# EAGLE schematic Main (EAGLE 9.2.2)
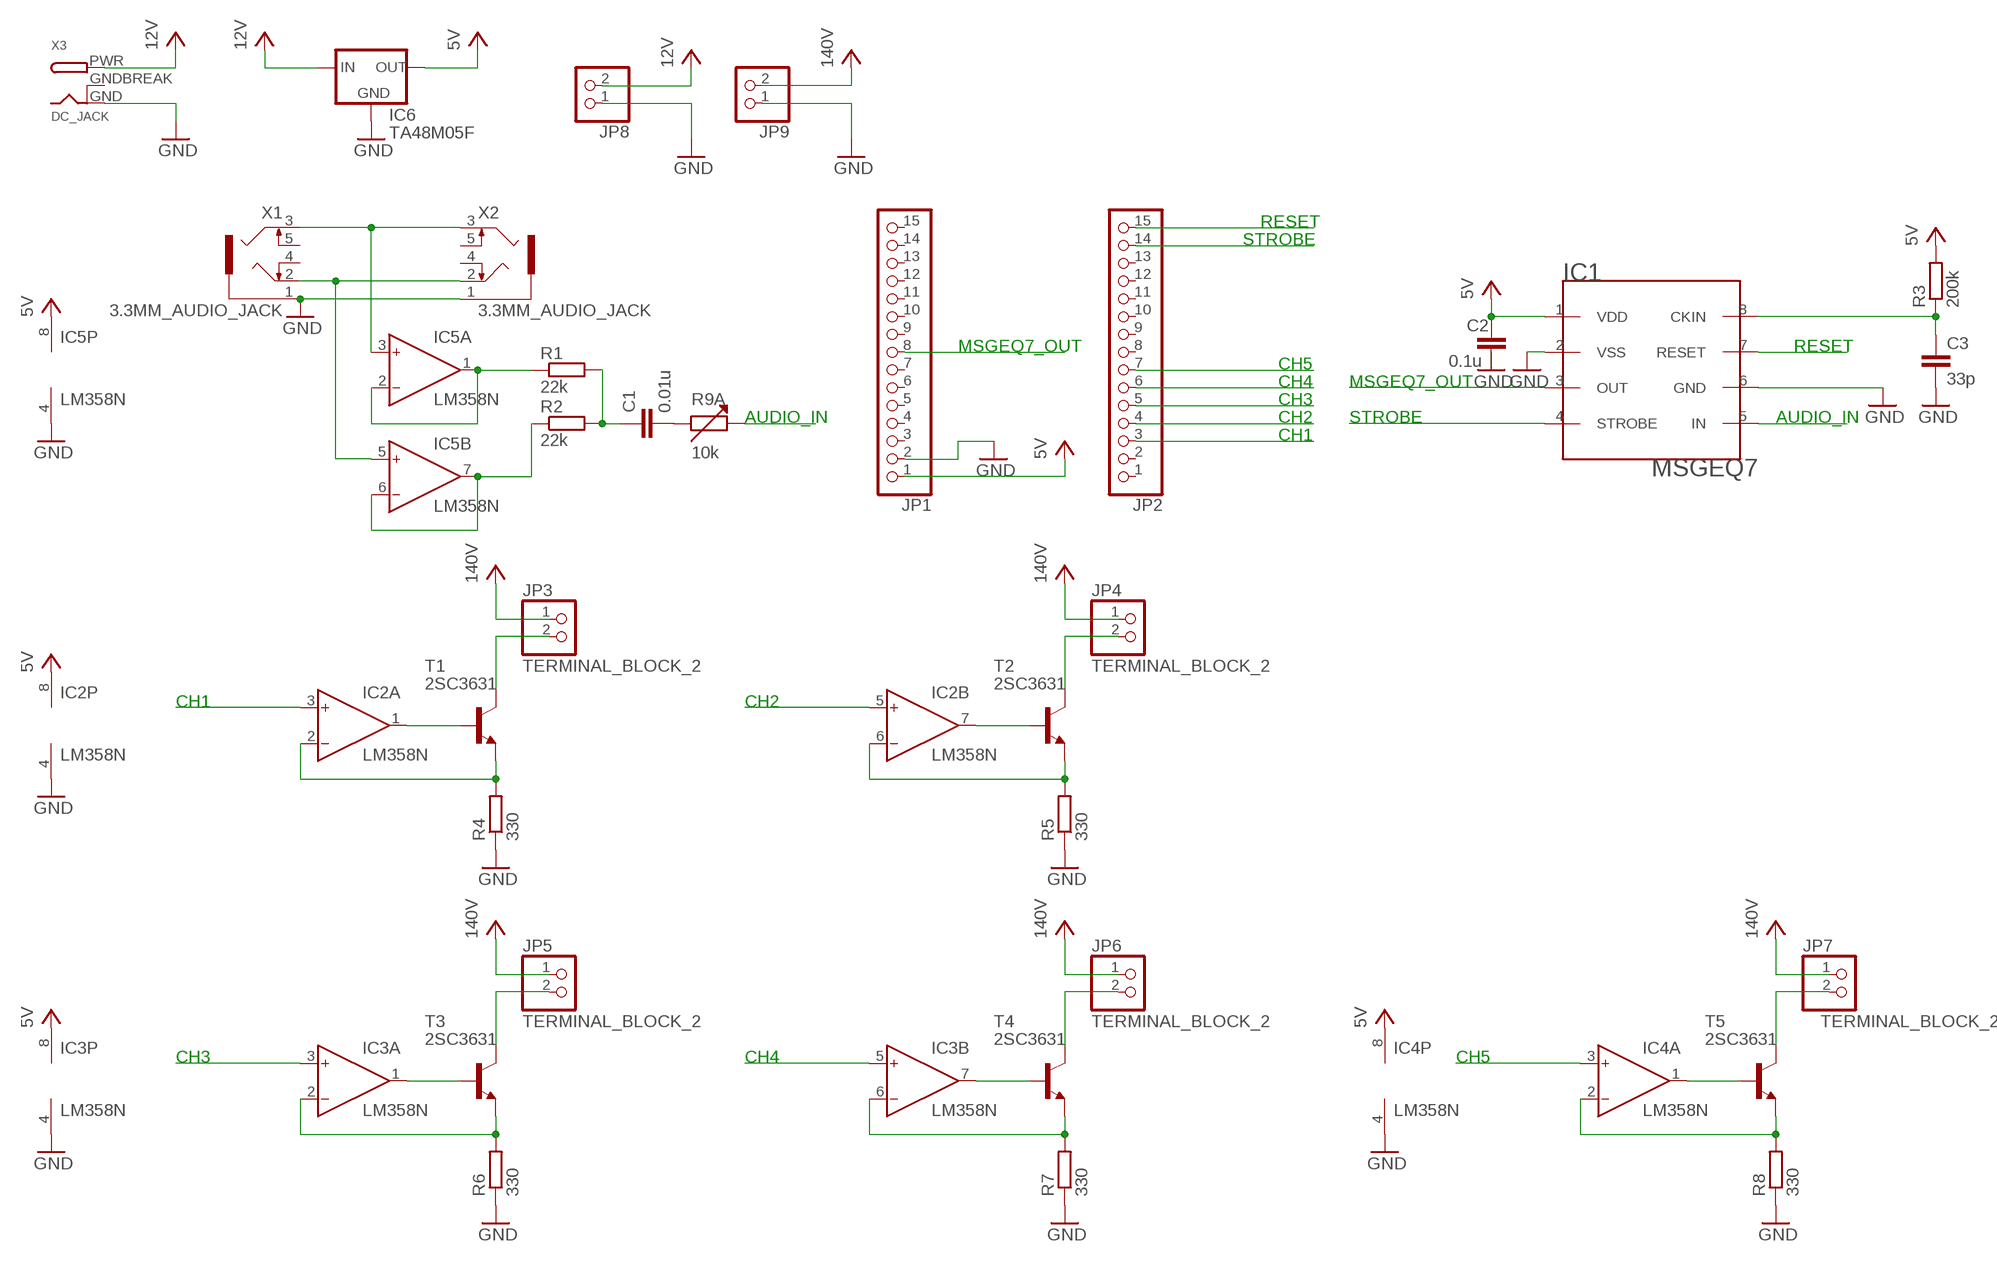
[diagram p0: schematic, sheet 1]

## Parts
C1  0.01u  CAPACITOR  [C025-025X050]
C2  0.1u  CAPACITOR  [C025-025X050]
C3  33p  CAPACITOR  [C025-025X050]
IC1  MSGEQ7  [DIL08]
IC2  LM358N  [DIL08]
IC3  LM358N  [DIL08]
IC4  LM358N  [DIL08]
IC5  LM358N  [DIL08]
IC6  TA48M05F  [TA48M05F]
JP1  PINHD-1X15  [1X15]
JP2  PINHD-1X15  [1X15]
JP3  TERMINAL_BLOCK_2  [TERMINAL_BLOCK_2]
JP4  TERMINAL_BLOCK_2  [TERMINAL_BLOCK_2]
JP5  TERMINAL_BLOCK_2  [TERMINAL_BLOCK_2]
JP6  TERMINAL_BLOCK_2  [TERMINAL_BLOCK_2]
JP7  TERMINAL_BLOCK_2  [TERMINAL_BLOCK_2]
JP8  PINHD-1X2  [1X02]
JP9  PINHD-1X2  [1X02]
R1  22k  RESISTOR  [0207/7]
R2  22k  RESISTOR  [0207/7]
R3  200k  RESISTOR  [0207/7]
R4  330  RESISTOR  [0207/7]
R5  330  RESISTOR  [0207/7]
R6  330  RESISTOR  [0207/7]
R7  330  RESISTOR  [0207/7]
R8  330  RESISTOR  [0207/7]
R9  10k  RK0972A103L15F  [RK0972A103L15F]
T1  2SC3631  [2SC3631]
T2  2SC3631  [2SC3631]
T3  2SC3631  [2SC3631]
T4  2SC3631  [2SC3631]
T5  2SC3631  [2SC3631]
X1  3.3MM_AUDIO_JACK  [1503_09]
X2  3.3MM_AUDIO_JACK  [1503_09]
X3  DC_JACK  [DC_JACK]

## Nets
GND: C2.2 C3.2 IC1.2(VSS) IC2.4(P:V-) IC3.4(P:V-) IC4.4(P:V-) IC5.4(P:V-) IC6.GND JP1.2 JP8.1 JP9.1 R4.1 R5.1 R6.1 R7.1 R8.1 X1.1 X2.1 X3.GND
N$1: C1.1 R1.2 R2.2
N$2: IC5.3(A:IN+) X1.3 X2.3
N$3: IC5.5(B:IN+) X1.2 X2.2
N$4: C1.2 R9.P$2
N$5: IC1.5(IN)
N$6: IC1.3(OUT)
N$7: IC1.4(STROBE)
N$8: IC1.7(RESET)
N$9: C3.1 IC1.8(CKIN) R3.1
N$10: JP1.8
N$11: JP2.15
N$12: JP2.14
N$13: JP2.5
N$14: JP2.3
N$15: JP2.4
N$16: JP2.6
N$17: JP2.7
N$18: JP3.2 T1.2(C)
N$19: IC2.2(A:IN-) R4.2 T1.3(E)
N$20: IC2.1(A:OUT) T1.1(B)
N$21: JP4.2 T2.2(C)
N$22: IC2.3(A:IN+)
N$23: IC2.6(B:IN-) R5.2 T2.3(E)
N$24: IC2.7(B:OUT) T2.1(B)
N$25: IC2.5(B:IN+)
N$26: JP5.2 T3.2(C)
N$27: IC3.2(A:IN-) R6.2 T3.3(E)
N$28: IC3.1(A:OUT) T3.1(B)
N$29: IC3.3(A:IN+)
N$30: JP6.2 T4.2(C)
N$31: IC3.6(B:IN-) R7.2 T4.3(E)
N$32: IC3.7(B:OUT) T4.1(B)
N$33: IC3.5(B:IN+)
N$34: JP7.2 T5.2(C)
N$35: IC4.2(A:IN-) R8.2 T5.3(E)
N$36: IC4.1(A:OUT) T5.1(B)
N$37: IC4.3(A:IN+)
N$38: R9.P$1
N$39: IC5.1(A:OUT) IC5.2(A:IN-) R1.1
N$40: IC1.6(GND) ; supply symbol labelled GND
N$42: IC5.6(B:IN-) IC5.7(B:OUT) R2.1
VCC: C2.1 IC1.1(VDD) IC2.8(P:V+) IC3.8(P:V+) IC4.8(P:V+) IC5.8(P:V+) IC6.IN IC6.OUT JP1.1 JP3.1 JP4.1 JP5.1 JP6.1 JP7.1 JP8.2 JP9.2 R3.2 X3.PWR ; supply symbol labelled 12V, 5V, 140V
Unconnected: IC4.5(B:IN+) IC4.6(B:IN-) IC4.7(B:OUT) JP1.3 JP1.4 JP1.5 JP1.6 JP1.7 JP1.9 JP1.10 JP1.11 JP1.12 JP1.13 JP1.14 JP1.15 JP2.1 JP2.2 JP2.8 JP2.9 JP2.10 JP2.11 JP2.12 JP2.13 R9.P$4 R9.P$5 X1.4 X1.5 X2.4 X2.5

## Notes on the sheet
- RESET
- STROBE
- MSGEQ7_OUT | RESET
- CH5
- CH4 | MSGEQ7_OUT
- CH3
- AUDIO_IN | CH2 | STROBE | AUDIO_IN
- CH1
- CH1 | CH2
- CH3 | CH4 | CH5

## Power pins joined to a net without a drawn wire
GNDBREAK: X3.GNDBREAK

## Library data of the parts
C1-C3 = SpectralAnalyzer:CAPACITOR
IC1 = SpectralAnalyzer:MSGEQ7: Seven Band Graphic Equalizer
IC2-IC5 = SpectralAnalyzer:LM358N
IC6 = SpectralAnalyzer:TA48M05F: VOLTAGE REGULATOR
JP1 JP2 = SpectralAnalyzer:PINHD-1X15: PIN HEADER
JP3-JP7 = SpectralAnalyzer:TERMINAL_BLOCK_2
JP8 JP9 = SpectralAnalyzer:PINHD-1X2: PIN HEADER
R1-R8 = SpectralAnalyzer:RESISTOR
R9 = SpectralAnalyzer:RK0972A103L15F
T1-T5 = SpectralAnalyzer:2SC3631: NPN Epitaxial Planar Trnasitor RF Power Amplifier Source: 2SC3212.pdf
X1 X2 = SpectralAnalyzer:3.3MM_AUDIO_JACK: Jack connectors according to JISC 6560, 3.5 mm Klinkeneinbaukupplung nach JISC 6560, 3,5 mm, 3-polig/ stereo, abgewinkelte Ausführung, mit 2 Öffnern und Lötaugen, für Leiterplatten Rückseitenmontage Source: http://www.lumberg.com/Produkte/PDFs/1503_09.pdf
X3 = SpectralAnalyzer:DC_JACK